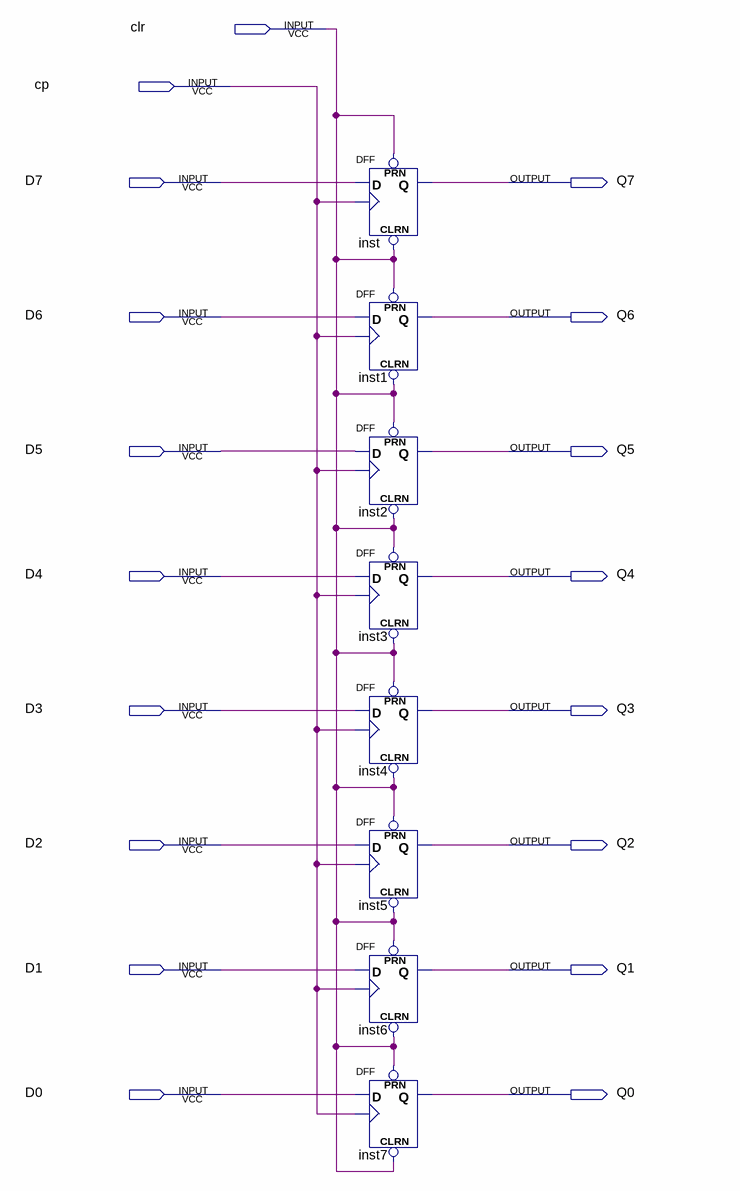
[diagram p0: schematic sheet]
// Quartus schematic register-8.bdf as structural Verilog: 8 symbols, 18 pins
module \register-8  (
  input  clr,
  input  cp,
  input  D7,
  input  D6,
  input  D5,
  input  D4,
  input  D3,
  input  D2,
  input  D1,
  input  D0,
  output Q7,
  output Q6,
  output Q5,
  output Q4,
  output Q3,
  output Q2,
  output Q1,
  output Q0
);

  DFF inst (.CLRN(clr), .CLK(cp), .D(D7), .PRN(clr), .Q(Q7));
  DFF inst1 (.CLRN(clr), .CLK(cp), .D(D6), .PRN(clr), .Q(Q6));
  DFF inst2 (.CLRN(clr), .CLK(cp), .D(D5), .PRN(clr), .Q(Q5));
  DFF inst3 (.CLRN(clr), .CLK(cp), .D(D4), .PRN(clr), .Q(Q4));
  DFF inst4 (.CLRN(clr), .CLK(cp), .D(D3), .PRN(clr), .Q(Q3));
  DFF inst5 (.CLRN(clr), .CLK(cp), .D(D2), .PRN(clr), .Q(Q2));
  DFF inst6 (.CLRN(clr), .CLK(cp), .D(D1), .PRN(clr), .Q(Q1));
  DFF inst7 (.CLRN(clr), .CLK(cp), .D(D0), .PRN(clr), .Q(Q0));
endmodule
